# Altium schematic sheet DDR3L.SchDoc
size A4; SheetNumber: 7; SheetTotal: 8
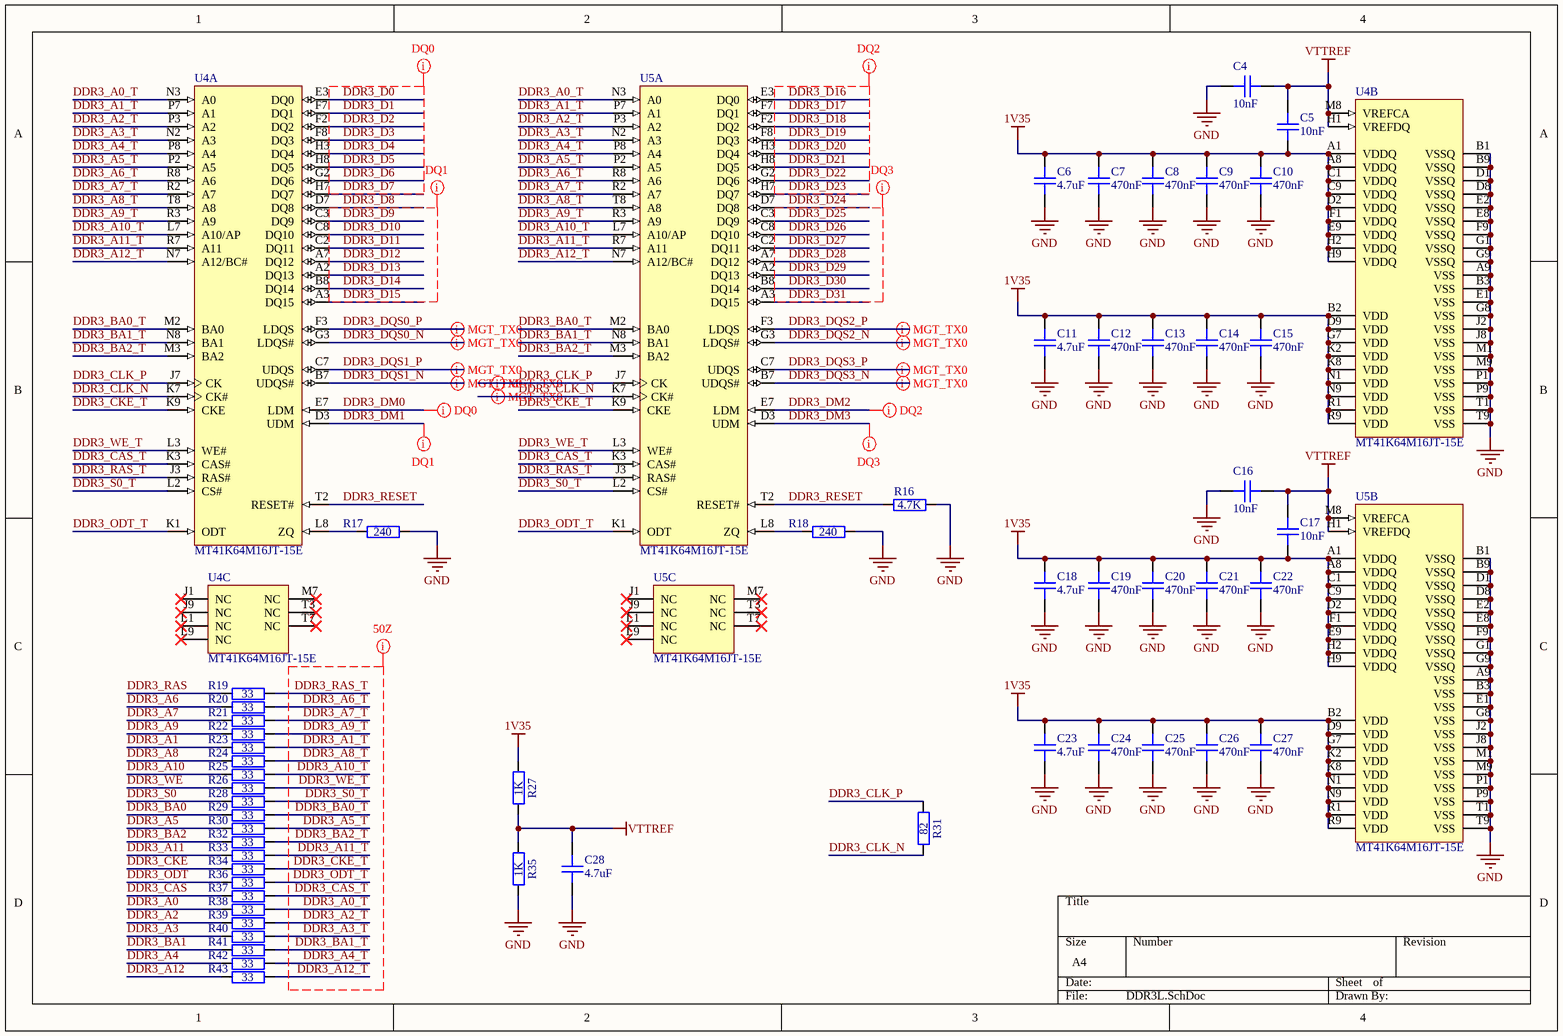
[diagram p0: DDR3L.SchDoc]

## Parts
C4  10nF  [GEN_C_0402]
C5  10nF  [GEN_C_0402]
C6  4.7uF  [GEN_C_0402]
C7  470nF  [GEN_C_0201]
C8  470nF  [GEN_C_0201]
C9  470nF  [GEN_C_0201]
C10  470nF  [GEN_C_0201]
C11  4.7uF  [GEN_C_0402]
C12  470nF  [GEN_C_0201]
C13  470nF  [GEN_C_0201]
C14  470nF  [GEN_C_0201]
C15  470nF  [GEN_C_0201]
C16  10nF  [GEN_C_0402]
C17  10nF  [GEN_C_0402]
C18  4.7uF  [GEN_C_0402]
C19  470nF  [GEN_C_0201]
C20  470nF  [GEN_C_0201]
C21  470nF  [GEN_C_0201]
C22  470nF  [GEN_C_0201]
C23  4.7uF  [GEN_C_0402]
C24  470nF  [GEN_C_0201]
C25  470nF  [GEN_C_0201]
C26  470nF  [GEN_C_0201]
C27  470nF  [GEN_C_0201]
C28  4.7uF  [GEN_C_0402]
R16  4.7K  [GEN_R_0402]
R17  240  [GEN_R_0402]
R18  240  [GEN_R_0402]
R19  33  [GEN_R_0201]
R20  33  [GEN_R_0201]
R21  33  [GEN_R_0201]
R22  33  [GEN_R_0201]
R23  33  [GEN_R_0201]
R24  33  [GEN_R_0201]
R25  33  [GEN_R_0201]
R26  33  [GEN_R_0201]
R27  1K  [GEN_R_0402]
R28  33  [GEN_R_0201]
R29  33  [GEN_R_0201]
R30  33  [GEN_R_0201]
R31  82  [GEN_R_0402]
R32  33  [GEN_R_0201]
R33  33  [GEN_R_0201]
R34  33  [GEN_R_0201]
R35  1K  [GEN_R_0402]
R36  33  [GEN_R_0201]
R37  33  [GEN_R_0201]
R38  33  [GEN_R_0201]
R39  33  [GEN_R_0201]
R40  33  [GEN_R_0201]
R41  33  [GEN_R_0201]
R42  33  [GEN_R_0201]
R43  33  [GEN_R_0201]
U4  MT41K64M16JT-15E  [MICT-JT-96]  (parts A,B,C of 3)
U5  MT41K64M16JT-15E  [MICT-JT-96]  (parts A,B,C of 3)

## Nets
1V35: C5.2 C6.2 C7.2 C8.2 C9.2 C10.2 C11.2 C12.2 C13.2 C14.2 C15.2 C17.2 C18.2 C19.2 C20.2 C21.2 C22.2 C23.2 C24.2 C25.2 C26.2 C27.2 R27.2 U4.A1(VDDQ) U4.A8(VDDQ) U4.B2(VDD) U4.C1(VDDQ) U4.C9(VDDQ) U4.D2(VDDQ) U4.D9(VDD) U4.E9(VDDQ) U4.F1(VDDQ) U4.G7(VDD) U4.H2(VDDQ) U4.H9(VDDQ) U4.K2(VDD) U4.K8(VDD) U4.N1(VDD) U4.N9(VDD) U4.R1(VDD) U4.R9(VDD) U5.A1(VDDQ) U5.A8(VDDQ) U5.B2(VDD) U5.C1(VDDQ) U5.C9(VDDQ) U5.D2(VDDQ) U5.D9(VDD) U5.E9(VDDQ) U5.F1(VDDQ) U5.G7(VDD) U5.H2(VDDQ) U5.H9(VDDQ) U5.K2(VDD) U5.K8(VDD) U5.N1(VDD) U5.N9(VDD) U5.R1(VDD) U5.R9(VDD)
GND: C4.1 C6.1 C7.1 C8.1 C9.1 C10.1 C11.1 C12.1 C13.1 C14.1 C15.1 C16.1 C18.1 C19.1 C20.1 C21.1 C22.1 C23.1 C24.1 C25.1 C26.1 C27.1 C28.1 R16.2 R17.2 R18.2 R35.1 U4.A9(VSS) U4.B1(VSSQ) U4.B3(VSS) U4.B9(VSSQ) U4.D1(VSSQ) U4.D8(VSSQ) U4.E1(VSS) U4.E2(VSSQ) U4.E8(VSSQ) U4.F9(VSSQ) U4.G1(VSSQ) U4.G8(VSS) U4.G9(VSSQ) U4.J2(VSS) U4.J8(VSS) U4.M1(VSS) U4.M9(VSS) U4.P1(VSS) U4.P9(VSS) U4.T1(VSS) U4.T9(VSS) U5.A9(VSS) U5.B1(VSSQ) U5.B3(VSS) U5.B9(VSSQ) U5.D1(VSSQ) U5.D8(VSSQ) U5.E1(VSS) U5.E2(VSSQ) U5.E8(VSSQ) U5.F9(VSSQ) U5.G1(VSSQ) U5.G8(VSS) U5.G9(VSSQ) U5.J2(VSS) U5.J8(VSS) U5.M1(VSS) U5.M9(VSS) U5.P1(VSS) U5.P9(VSS) U5.T1(VSS) U5.T9(VSS)
VTTREF: C4.2 C5.1 C16.2 C17.1 C28.2 R27.1 R35.2 U4.H1(VREFDQ) U4.M8(VREFCA) U5.H1(VREFDQ) U5.M8(VREFCA)
DDR3_A0: R38.1
DDR3_A0_T: R38.2 U4.N3(A0) U5.N3(A0)
DDR3_A1: R23.1
DDR3_A1_T: R23.2 U4.P7(A1) U5.P7(A1)
DDR3_A2: R39.1
DDR3_A2_T: R39.2 U4.P3(A2) U5.P3(A2)
DDR3_A3: R40.1
DDR3_A3_T: R40.2 U4.N2(A3) U5.N2(A3)
DDR3_A4: R42.1
DDR3_A4_T: R42.2 U4.P8(A4) U5.P8(A4)
DDR3_A5: R30.1
DDR3_A5_T: R30.2 U4.P2(A5) U5.P2(A5)
DDR3_A6: R20.1
DDR3_A6_T: R20.2 U4.R8(A6) U5.R8(A6)
DDR3_A7: R21.1
DDR3_A7_T: R21.2 U4.R2(A7) U5.R2(A7)
DDR3_A8: R24.1
DDR3_A8_T: R24.2 U4.T8(A8) U5.T8(A8)
DDR3_A9: R22.1
DDR3_A9_T: R22.2 U4.R3(A9) U5.R3(A9)
DDR3_A10: R25.1
DDR3_A10_T: R25.2 U4.L7(A10/AP) U5.L7(A10/AP)
DDR3_A11: R33.1
DDR3_A11_T: R33.2 U4.R7(A11) U5.R7(A11)
DDR3_A12: R43.1
DDR3_A12_T: R43.2 U4.N7(A12/BC#) U5.N7(A12/BC#)
DDR3_BA0: R29.1
DDR3_BA0_T: R29.2 U4.M2(BA0) U5.M2(BA0)
DDR3_BA1: R41.1
DDR3_BA1_T: R41.2 U4.N8(BA1) U5.N8(BA1)
DDR3_BA2: R32.1
DDR3_BA2_T: R32.2 U4.M3(BA2) U5.M3(BA2)
DDR3_CAS: R37.1
DDR3_CAS_T: R37.2 U4.K3(CAS#) U5.K3(CAS#)
DDR3_CKE: R34.1
DDR3_CKE_T: R34.2 U4.K9(CKE) U5.K9(CKE)
DDR3_CLK_N: R31.1 U4.K7(CK#) U5.K7(CK#)
DDR3_CLK_P: R31.2 U4.J7(CK) U5.J7(CK)
DDR3_D0: U4.E3(DQ0)
DDR3_D1: U4.F7(DQ1)
DDR3_D2: U4.F2(DQ2)
DDR3_D3: U4.F8(DQ3)
DDR3_D4: U4.H3(DQ4)
DDR3_D5: U4.H8(DQ5)
DDR3_D6: U4.G2(DQ6)
DDR3_D7: U4.H7(DQ7)
DDR3_D8: U4.D7(DQ8)
DDR3_D9: U4.C3(DQ9)
DDR3_D10: U4.C8(DQ10)
DDR3_D11: U4.C2(DQ11)
DDR3_D12: U4.A7(DQ12)
DDR3_D13: U4.A2(DQ13)
DDR3_D14: U4.B8(DQ14)
DDR3_D15: U4.A3(DQ15)
DDR3_D16: U5.E3(DQ0)
DDR3_D17: U5.F7(DQ1)
DDR3_D18: U5.F2(DQ2)
DDR3_D19: U5.F8(DQ3)
DDR3_D20: U5.H3(DQ4)
DDR3_D21: U5.H8(DQ5)
DDR3_D22: U5.G2(DQ6)
DDR3_D23: U5.H7(DQ7)
DDR3_D24: U5.D7(DQ8)
DDR3_D25: U5.C3(DQ9)
DDR3_D26: U5.C8(DQ10)
DDR3_D27: U5.C2(DQ11)
DDR3_D28: U5.A7(DQ12)
DDR3_D29: U5.A2(DQ13)
DDR3_D30: U5.B8(DQ14)
DDR3_D31: U5.A3(DQ15)
DDR3_DM0: U4.E7(LDM)
DDR3_DM1: U4.D3(UDM)
DDR3_DM2: U5.E7(LDM)
DDR3_DM3: U5.D3(UDM)
DDR3_DQS0_N: U4.G3(LDQS#)
DDR3_DQS0_P: U4.F3(LDQS)
DDR3_DQS1_N: U4.B7(UDQS#)
DDR3_DQS1_P: U4.C7(UDQS)
DDR3_DQS2_N: U5.G3(LDQS#)
DDR3_DQS2_P: U5.F3(LDQS)
DDR3_DQS3_N: U5.B7(UDQS#)
DDR3_DQS3_P: U5.C7(UDQS)
DDR3_ODT: R36.1
DDR3_ODT_T: R36.2 U4.K1(ODT) U5.K1(ODT)
DDR3_RAS: R19.1
DDR3_RAS_T: R19.2 U4.J3(RAS#) U5.J3(RAS#)
DDR3_RESET: R16.1 U4.T2(RESET#) U5.T2(RESET#)
DDR3_S0: R28.1
DDR3_S0_T: R28.2 U4.L2(CS#) U5.L2(CS#)
DDR3_WE: R26.1
DDR3_WE_T: R26.2 U4.L3(WE#) U5.L3(WE#)
NetR17_1: R17.1 U4.L8(ZQ)
NetR18_1: R18.1 U5.L8(ZQ)

Not connected (* = marked no-connect by the designer): U4 J1(NC)* J9(NC)* L1(NC)* L9(NC)* M7(NC)* T3(NC)* T7(NC)*; U5 J1(NC)* J9(NC)* L1(NC)* L9(NC)* M7(NC)* T3(NC)* T7(NC)*

## Layout directives
net class DQ2: DDR3_D16, DDR3_D17, DDR3_D18, DDR3_D19, DDR3_D20, DDR3_D21, DDR3_D22, DDR3_D23, DDR3_DM2
net class DQ3: DDR3_D24, DDR3_D25, DDR3_D26, DDR3_D27, DDR3_D28, DDR3_D29, DDR3_D30, DDR3_D31, DDR3_DM3
net class DQ0: DDR3_D0, DDR3_D1, DDR3_D2, DDR3_D3, DDR3_D4, DDR3_D5, DDR3_D6, DDR3_D7, DDR3_DM0
net class DQ1: DDR3_D8, DDR3_D9, DDR3_D10, DDR3_D11, DDR3_D12, DDR3_D13, DDR3_D14, DDR3_D15, DDR3_DM1
differential pair; differential pair class DQS0: DDR3_DQS0_N, DDR3_DQS0_P
differential pair; differential pair class DQS1: DDR3_DQS1_N, DDR3_DQS1_P
differential pair; differential pair class DQS2: DDR3_DQS2_N, DDR3_DQS2_P
differential pair; differential pair class DQS3: DDR3_DQS3_N, DDR3_DQS3_P
differential pair; differential pair class DDR3_CLK: DDR3_CLK_N, DDR3_CLK_P
net class DDR3 ADDR: DDR3_A0_T, DDR3_A1_T, DDR3_A2_T, DDR3_A3_T, DDR3_A4_T, DDR3_A5_T, DDR3_A6_T, DDR3_A7_T, DDR3_A8_T, DDR3_A9_T, DDR3_A10_T, DDR3_A11_T, DDR3_A12_T, DDR3_BA0_T, DDR3_BA1_T, DDR3_BA2_T, DDR3_CAS_T, DDR3_CKE_T, DDR3_ODT_T, DDR3_RAS_T, DDR3_S0_T, DDR3_WE_T

## Library data of the parts
C4 C5 C16 C17 = CAP 10nF 50V X7R 0402: Voltage Rating: 50V; Package: 0402; Value: 10nF; Supplier 1: Digi-Key; Supplier Part Number 1: 490-6351-1-ND
C6 C11 C18 C23 C28 = CAP 4.7uF 6.3V X5R 0402: Voltage Rating: 6.3V; Package: 0402; Value: 4.7uF; Supplier 1: Digi-Key; Supplier Part Number 1: 490-5915-1-ND
C7-C10 C12-C15 C19-C22 C24-C27 = CAP 470nF 6.3V X5R 0201: Voltage Rating: 6.3V; Package: 0201; Value: 470nF; Supplier 1: Digi-Key; Supplier Part Number 1: 490-10409-1-ND
R16 = RES 4.7K OHM 1% 1/10W 0402: Tolerance: 1%; Power Rating: 0.1W; Package: 0402; Supplier 1: Digi-Key; Supplier Part Number 1: P4.70KLCT-ND; Value: 4.7K
R17 R18 = RES 240 OHM 1% 1/16W 0402: Tolerance: 1%; Power Rating: 0.0625W; Package: 0402; Value: 240; Supplier 1: Digi-Key; Supplier Part Number 1: 311-240LRTR-ND
R19-R26 R28-R30 R32-R34 R36-R43 = RES 33 OHM 1% 1/20W 0201: Tolerance: 1%; Power Rating: 0.05W; Package: 0201; Value: 33; Supplier 1: Digi-Key; Supplier Part Number 1: RMCF0201FT33R0CT-ND
R27 R35 = RES 1K OHM 1% 1/10W 0402: Tolerance: 1%; Power Rating: 0.1W; Package: 0402; Value: 1K; Supplier 1: Digi-Key; Supplier Part Number 1: 311-1.00KLRCT-ND
R31 = RES 82 OHM 1% 1/16W 0402: Tolerance: 1%; Power Rating: 0.0625W; Package: 0402; Supplier 1: Digi-Key; Supplier Part Number 1: 311-82LRCT-ND; Value: 82
U4 U5 = MT41K64M16JT-15E: 1Gb DDR3-1333 SDRAM, 64Mb x 16, 1.5ns, 1.35V, 0 to 95 degC, 96-Ball FBGA, Pb-Free; Manufacturer: Micron; CL: CL = 9; Clock Rate: 667 MHz; Op. Temp.: 0C to +95C; DatasheetVersion: Rev.F; PackageVersion: Rev.G; PackageReference: MICT-JT-96; PackageDescription: 96-Ball Fine-Pitch Ball Grid Array, 14 x 8 mm, Pitch 0.8 mm; Cycle Time: 1.5ns; Data Rate: DDR3-1333; Density: 1Gb; Depth: 64Mb; Package: FBGA; Pin Count: 96-ball; RoHS: Yes; Voltage: 1.35V; Width: x16; Mounting Technology: Surface Mount; PartNumber: MT41K64M16JT-15E; ComponentLink1Description: Manufacturer URL; ComponentLink1URL: http://www.micron.com/; ComponentLink2Description: Datasheet; ComponentLink2URL: http://www.micron.com/~/media/Documents/Products/Data%20Sheet/DRAM/2Gb_DDR3_SDRAM.pdf; ComponentLink3Description: Package Specification; ComponentLink3URL: http://www.micron.com/~/media/Documents/Products/Data%20Sheet/DRAM/2Gb_DDR3_SDRAM.pdf